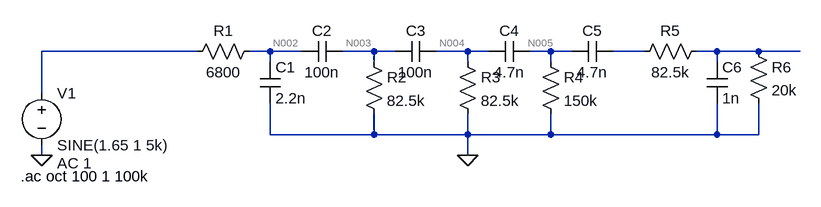
[diagram p0: schematic a weighting filter 2.asc]
a weighting filter 2.asc, the LTspice schematic file:
Version 4
SHEET 1 880 680
WIRE -656 192 -896 192
WIRE -544 192 -576 192
WIRE -496 192 -544 192
WIRE -384 192 -432 192
WIRE -352 192 -384 192
WIRE -240 192 -288 192
WIRE -208 192 -240 192
WIRE -112 192 -144 192
WIRE -80 192 -112 192
WIRE 32 192 -16 192
WIRE 144 192 112 192
WIRE 208 192 144 192
WIRE 272 192 208 192
WIRE -544 208 -544 192
WIRE -384 208 -384 192
WIRE -240 208 -240 192
WIRE -112 208 -112 192
WIRE 144 208 144 192
WIRE -896 256 -896 192
WIRE -544 320 -544 272
WIRE -384 320 -384 288
WIRE -384 320 -544 320
WIRE -240 320 -240 288
WIRE -240 320 -384 320
WIRE -112 320 -112 288
WIRE -112 320 -240 320
WIRE 144 320 144 272
WIRE 144 320 -112 320
WIRE 208 320 208 272
WIRE 208 320 144 320
WIRE -896 352 -896 336
WIRE -240 352 -240 320
FLAG -896 352 0
FLAG -240 352 0
SYMBOL voltage -896 240 R0
WINDOW 123 24 124 Left 2
WINDOW 39 0 0 Left 2
SYMATTR Value2 AC 1
SYMATTR InstName V1
SYMATTR Value SINE(1.65 1 5k)
SYMBOL res -560 176 R90
WINDOW 0 0 56 VBottom 2
WINDOW 3 32 56 VTop 2
SYMATTR InstName R1
SYMATTR Value 6800
SYMBOL cap -560 208 R0
SYMATTR InstName C1
SYMATTR Value 2.2n
SYMBOL cap -432 176 R90
WINDOW 0 0 32 VBottom 2
WINDOW 3 32 32 VTop 2
SYMATTR InstName C2
SYMATTR Value 100n
SYMBOL cap -288 176 R90
WINDOW 0 0 32 VBottom 2
WINDOW 3 32 32 VTop 2
SYMATTR InstName C3
SYMATTR Value 100n
SYMBOL cap -144 176 R90
WINDOW 0 0 32 VBottom 2
WINDOW 3 32 32 VTop 2
SYMATTR InstName C4
SYMATTR Value 4.7n
SYMBOL cap -16 176 R90
WINDOW 0 0 32 VBottom 2
WINDOW 3 32 32 VTop 2
SYMATTR InstName C5
SYMATTR Value 4.7n
SYMBOL res -400 192 R0
SYMATTR InstName R2
SYMATTR Value 82.5k
SYMBOL res -256 192 R0
SYMATTR InstName R3
SYMATTR Value 82.5k
SYMBOL res -128 192 R0
SYMATTR InstName R4
SYMATTR Value 150k
SYMBOL res 128 176 R90
WINDOW 0 0 56 VBottom 2
WINDOW 3 32 56 VTop 2
SYMATTR InstName R5
SYMATTR Value 82.5k
SYMBOL cap 128 208 R0
SYMATTR InstName C6
SYMATTR Value 1n
SYMBOL res 192 176 R0
SYMATTR InstName R6
SYMATTR Value 20k
TEXT -928 384 Left 2 !.ac oct 100 1 100k

The netlist it stands for:
* a weighting filter 2.asc
V1 N001 0 SINE(1.65 1 5k) AC 1
R1 N002 N001 6800
C1 N002 0 2.2n
C2 N003 N002 100n
C3 N004 N003 100n
C4 N005 N004 4.7n
C5 N006 N005 4.7n
R2 N003 0 82.5k
R3 N004 0 82.5k
R4 N005 0 150k
R5 N007 N006 82.5k
C6 N007 0 1n
R6 N007 0 20k
.ac oct 100 1 100k
.backanno
.end

* Results of the author's LTspice run, read from the files saved beside the schematic
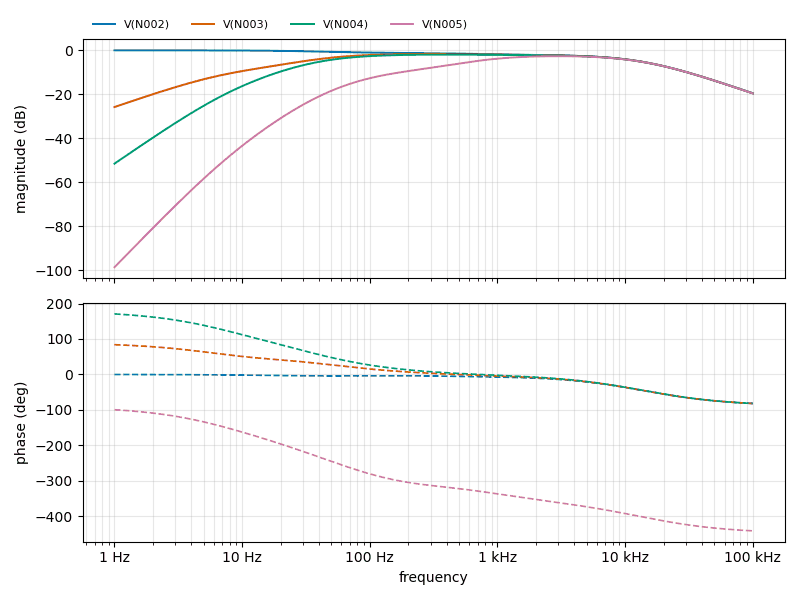
[diagram p1: AC Analysis of a weighting filter 2.asc, plotted from the saved traces]
* AC Analysis, 1 run:
*   V(N002): -0.00 dB at 1 Hz, -19.55 dB at 100 kHz, peak -0.00 dB at 1 Hz, 3 dB below the peak at 6.217 kHz
*   V(N003): -25.78 dB at 1 Hz, -19.55 dB at 100 kHz, peak -1.71 dB at 304.4 Hz, 3 dB below the peak at 32.39 Hz and 11.99 kHz
*   V(N004): -51.50 dB at 1 Hz, -19.55 dB at 100 kHz, peak -1.96 dB at 396.2 Hz, 3 dB below the peak at 42.47 Hz and 12.78 kHz
*   V(N005): -98.57 dB at 1 Hz, -19.55 dB at 100 kHz, peak -2.67 dB at 2.998 kHz, 3 dB below the peak at 544 Hz and 14.93 kHz